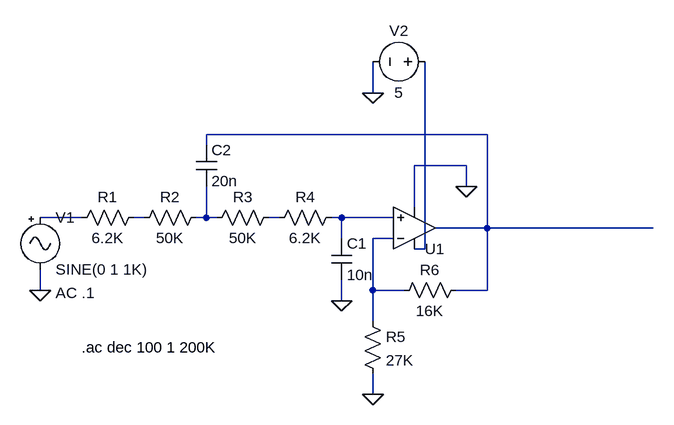
[diagram p0: schematic lpf.asc]
lpf.asc, the LTspice schematic file:
Version 4.1
SHEET 1 1492 680
WIRE 368 -64 368 -112
WIRE 544 0 112 0
WIRE 112 16 112 0
WIRE 512 48 432 48
WIRE 512 80 512 48
WIRE 432 112 432 48
WIRE -80 128 -144 128
WIRE 16 128 0 128
WIRE 112 128 112 80
WIRE 112 128 96 128
WIRE 128 128 112 128
WIRE 224 128 208 128
WIRE 320 128 304 128
WIRE 400 128 320 128
WIRE 544 144 544 0
WIRE 544 144 464 144
WIRE 800 144 544 144
WIRE 320 160 320 128
WIRE 400 160 368 160
WIRE 448 176 448 -112
WIRE 448 176 432 176
WIRE -144 240 -144 208
WIRE 368 240 368 160
WIRE 416 240 368 240
WIRE 544 240 544 144
WIRE 544 240 496 240
WIRE 320 256 320 224
WIRE 368 288 368 240
WIRE 368 400 368 368
FLAG 320 256 0
FLAG -144 240 0
FLAG 368 -64 0
FLAG 368 400 0
FLAG 512 80 0
SYMBOL OpAmps\\UniversalOpAmp2 432 144 M180
SYMATTR InstName U1
SYMBOL res 16 112 R90
WINDOW 0 0 56 VBottom 2
WINDOW 3 32 56 VTop 2
SYMATTR InstName R1
SYMATTR Value 6.2K
SYMBOL res 112 112 R90
WINDOW 0 0 56 VBottom 2
WINDOW 3 32 56 VTop 2
SYMATTR InstName R2
SYMATTR Value 50K
SYMBOL res 224 112 R90
WINDOW 0 0 56 VBottom 2
WINDOW 3 32 56 VTop 2
SYMATTR InstName R3
SYMATTR Value 50K
SYMBOL res 320 112 R90
WINDOW 0 0 56 VBottom 2
WINDOW 3 32 56 VTop 2
SYMATTR InstName R4
SYMATTR Value 6.2K
SYMBOL cap 304 160 R0
SYMATTR InstName C1
SYMATTR Value 10n
SYMBOL cap 96 16 R0
SYMATTR InstName C2
SYMATTR Value 20n
SYMBOL Misc\\signal -144 112 R0
WINDOW 123 24 132 Left 2
WINDOW 39 0 0 Left 0
SYMATTR Value2 AC .1
SYMATTR InstName V1
SYMBOL voltage 464 -112 R90
WINDOW 0 -32 56 VBottom 2
WINDOW 3 32 56 VTop 2
SYMATTR InstName V2
SYMATTR Value 5
SYMBOL res 352 272 R0
SYMATTR InstName R5
SYMATTR Value 27K
SYMBOL res 512 224 R90
WINDOW 0 0 56 VBottom 2
WINDOW 3 32 56 VTop 2
SYMATTR InstName R6
SYMATTR Value 16K
TEXT -80 328 Left 2 !.ac dec 100 1 200K

The netlist it stands for:
* lpf.asc
X§U1 N006 N007 N008 0 N001 level2 Avol=1Meg GBW=10Meg Slew=10Meg Ilimit=25m Rail=0 Vos=0 En=0 Enk=0 In=0 Ink=0 Rin=500Meg  ; pins In+ In- V+ V- OUT
R1 N003 N002 6.2K
R2 N004 N003 50K
R3 N005 N004 50K
R4 N006 N005 6.2K
C1 N006 0 10n
C2 N001 N004 20n
V1 N002 0 SINE(0 1 1K) AC .1
V2 N008 0 5
R5 N007 0 27K
R6 N001 N007 16K
.ac dec 100 1 200K
.lib UniversalOpAmp2.lib
.backanno
.end